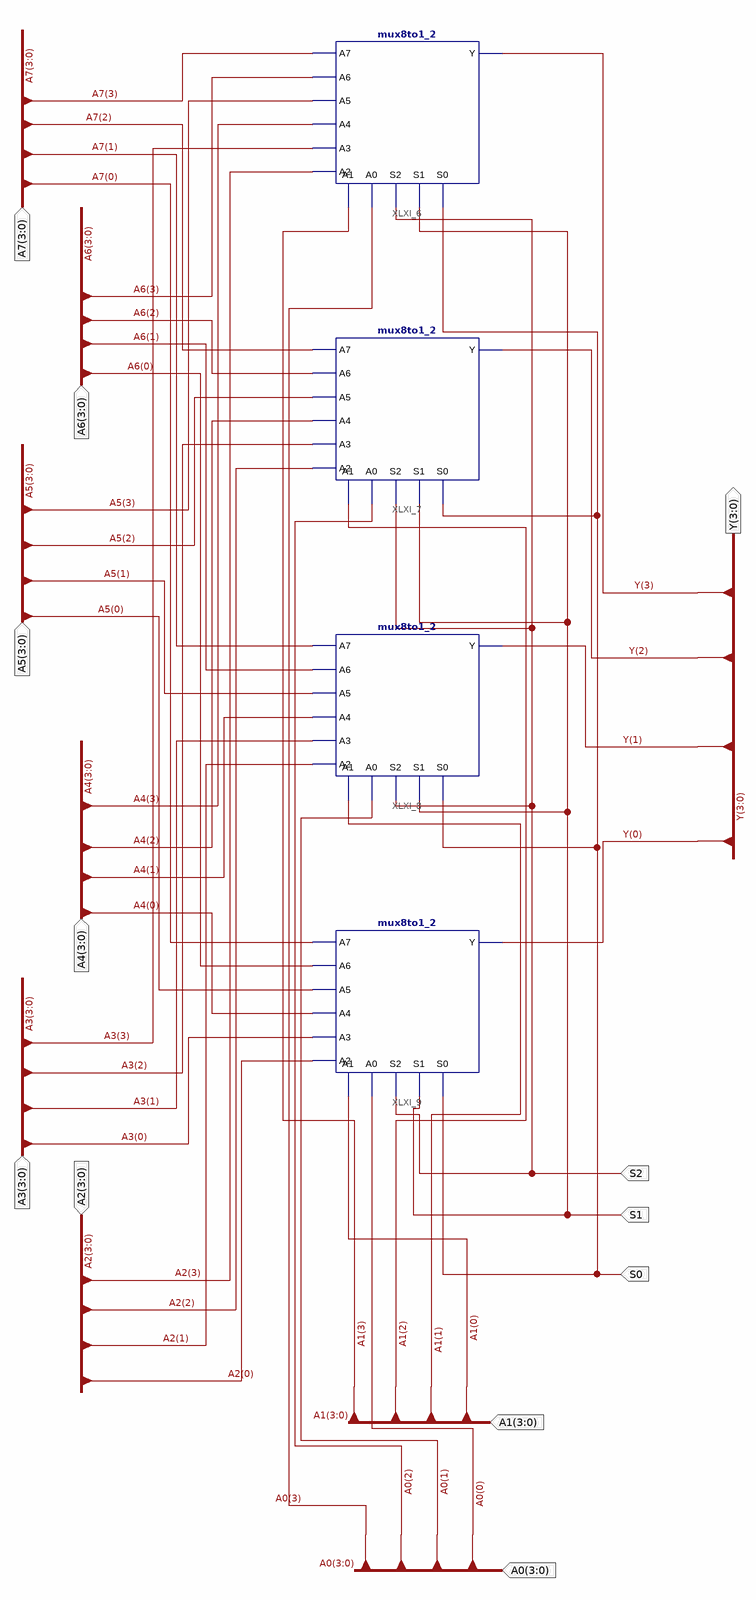
[diagram p0: schematic sheet 1]
// Xilinx ISE schematic mux4bit8to1.sch (spartan3e) as structural Verilog: 4 symbols, 12 ports
module mux4bit8to1 (
  input  [3:0] A6,
  input  [3:0] A3,
  input  [3:0] A2,
  input  [3:0] A5,
  input  [3:0] A4,
  input  [3:0] A7,
  input  [3:0] A1,
  input  [3:0] A0,
  input  S2,
  input  S1,
  input  S0,
  output [3:0] Y
);

  mux8to1_2 XLXI_6 (
    .A7(A7[3]), .A6(A6[3]), .A5(A5[3]), .A4(A4[3]), .A3(A3[3]), .A2(A2[3]), .Y(Y[3]), .A1(A1[3]), .A0(A0[3]),
    .S1(S1), .S0(S0), .S2(S2));
  mux8to1_2 XLXI_7 (
    .A7(A7[2]), .A6(A6[2]), .A5(A5[2]), .A4(A4[2]), .A3(A3[2]), .A2(A2[2]), .Y(Y[2]), .A1(A1[2]), .A0(A0[2]),
    .S1(S1), .S0(S0), .S2(S2));
  mux8to1_2 XLXI_8 (
    .A7(A7[1]), .A6(A6[1]), .A5(A5[1]), .A4(A4[1]), .A3(A3[1]), .A2(A2[1]), .Y(Y[1]), .A1(A1[1]), .A0(A0[1]),
    .S1(S1), .S0(S0), .S2(S2));
  mux8to1_2 XLXI_9 (
    .A7(A7[0]), .A6(A6[0]), .A5(A5[0]), .A4(A4[0]), .A3(A3[0]), .A2(A2[0]), .Y(Y[0]), .A1(A1[0]), .A0(A0[0]),
    .S1(S1), .S0(S0), .S2(S2));
endmodule
